# EAGLE design M8357pld (EAGLE 4.11)
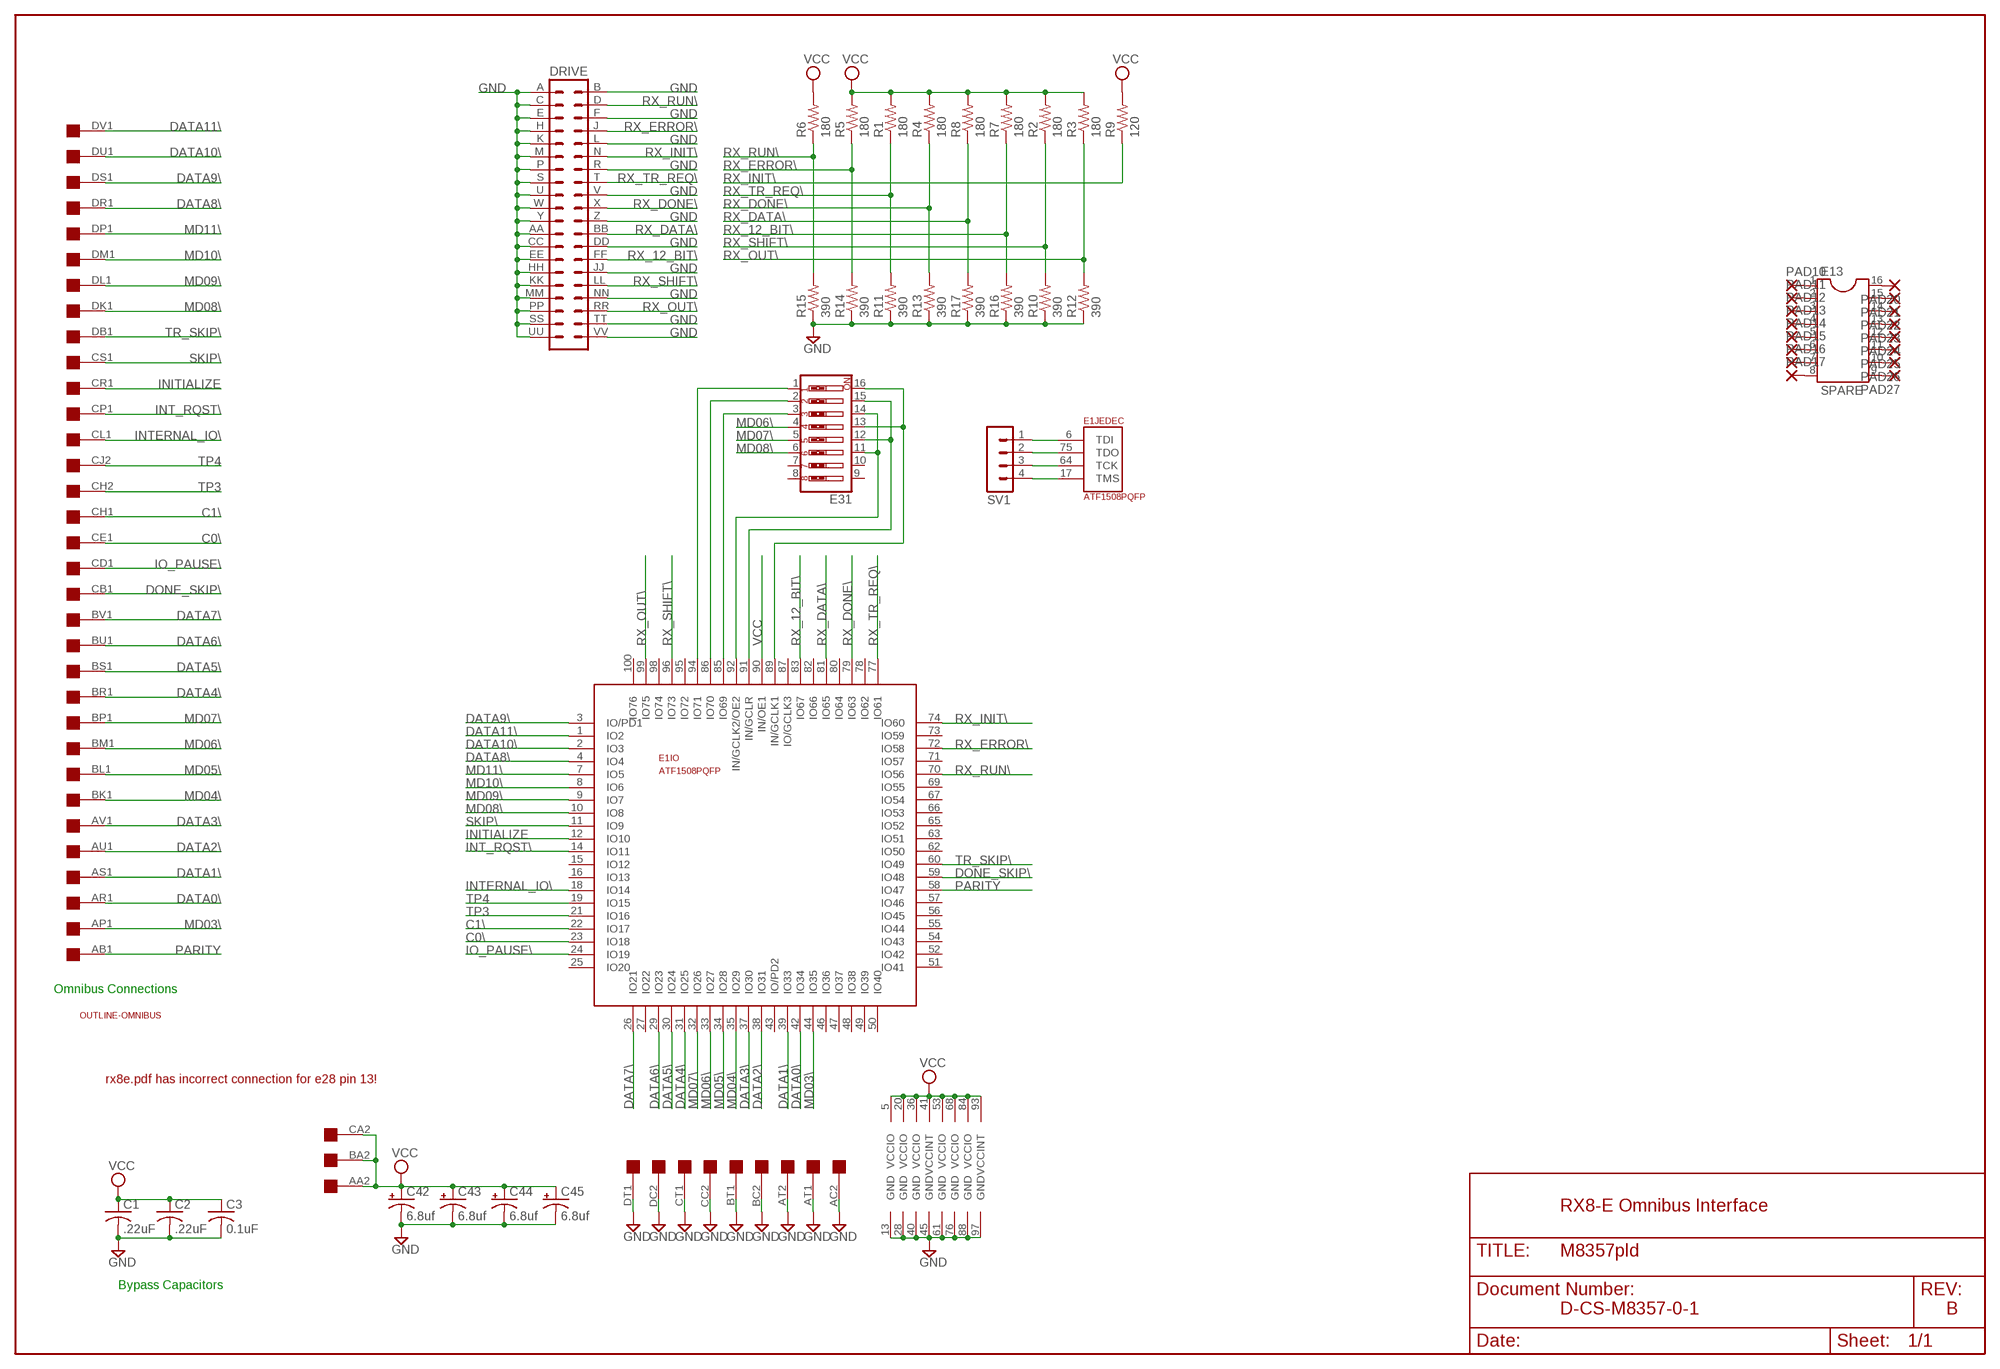
[diagram p0: schematic, sheet 1]

## Parts
C1  .22uF  C-US050-025X075  [C050-025X075]
C2  .22uF  C-US050-025X075  [C050-025X075]
C3  0.1uF  C-US050-025X075  [C050-025X075]
C42  6.8uf  CPOL-USE22-6AXIAL  [E22-6]
C43  6.8uf  CPOL-USE22-6AXIAL  [E22-6]
C44  6.8uf  CPOL-USE22-6AXIAL  [E22-6]
C45  6.8uf  CPOL-USE22-6AXIAL  [E22-6]
DRIVE  DEC40PINH  [DEC40PINH]
E1  ATF1508PQFP  [PQFP-100]
E13  SPARE  DIL16  [DIL16]
E31  SW_DIP-8  [EDG-08]
PAD10  1,6/0,8  [1,6/0,8]
PAD11  1,6/0,8  [1,6/0,8]
PAD12  1,6/0,8  [1,6/0,8]
PAD13  1,6/0,8  [1,6/0,8]
PAD14  1,6/0,8  [1,6/0,8]
PAD15  1,6/0,8  [1,6/0,8]
PAD16  1,6/0,8  [1,6/0,8]
PAD17  1,6/0,8  [1,6/0,8]
PAD20  1,6/0,8  [1,6/0,8]
PAD21  1,6/0,8  [1,6/0,8]
PAD22  1,6/0,8  [1,6/0,8]
PAD23  1,6/0,8  [1,6/0,8]
PAD24  1,6/0,8  [1,6/0,8]
PAD25  1,6/0,8  [1,6/0,8]
PAD26  1,6/0,8  [1,6/0,8]
PAD27  1,6/0,8  [1,6/0,8]
R1  180  R-US_0207/10  [0207/10]
R2  180  R-US_0207/10  [0207/10]
R3  180  R-US_0207/10  [0207/10]
R4  180  R-US_0207/10  [0207/10]
R5  180  R-US_0207/10  [0207/10]
R6  180  R-US_0207/10  [0207/10]
R7  180  R-US_0207/10  [0207/10]
R8  180  R-US_0207/10  [0207/10]
R9  120  R-US_0207/10  [0207/10]
R10  390  R-US_0207/10  [0207/10]
R11  390  R-US_0207/10  [0207/10]
R12  390  R-US_0207/10  [0207/10]
R13  390  R-US_0207/10  [0207/10]
R14  390  R-US_0207/10  [0207/10]
R15  390  R-US_0207/10  [0207/10]
R16  390  R-US_0207/10  [0207/10]
R17  390  R-US_0207/10  [0207/10]
SV1  MA04-1  [MA04-1]
U$2  QUAD  [EDGE-CON8]
U$5  OUTLINE-OMNIBUS  [OMNIBUS]

## Nets
C0\: E1.23(IO:IO18) U$2.CE1
C1\: E1.22(IO:IO17) U$2.CH1
DATA0\: E1.42(IO:IO34) U$2.AR1
DATA1\: E1.39(IO:IO33) U$2.AS1
DATA2\: E1.38(IO:IO31) U$2.AU1
DATA3\: E1.37(IO:IO30) U$2.AV1
DATA4\: E1.31(IO:IO25) U$2.BR1
DATA5\: E1.30(IO:IO24) U$2.BS1
DATA6\: E1.29(IO:IO23) U$2.BU1
DATA7\: E1.26(IO:IO21) U$2.BV1
DATA8\: E1.4(IO:IO4) U$2.DR1
DATA9\: E1.3(IO:IO/PD1) U$2.DS1
DATA10\: E1.2(IO:IO3) U$2.DU1
DATA11\: E1.1(IO:IO2) U$2.DV1
DONE_SKIP\: E1.59(IO:IO48) U$2.CB1
GND [supply]: C1.2 C2.2 C3.2 C42.- C43.- C44.- C45.- DRIVE.A DRIVE.AA DRIVE.B DRIVE.C DRIVE.CC DRIVE.DD DRIVE.E DRIVE.EE DRIVE.F DRIVE.H DRIVE.HH DRIVE.JJ DRIVE.K DRIVE.KK DRIVE.L DRIVE.M DRIVE.MM DRIVE.NN DRIVE.P DRIVE.PP DRIVE.R DRIVE.S DRIVE.SS DRIVE.TT DRIVE.U DRIVE.UU DRIVE.V DRIVE.VV DRIVE.W DRIVE.Y DRIVE.Z E1.13(GND) E1.28(GND) E1.40(GND) E1.45(GND) E1.61(GND) E1.76(GND) E1.88(GND) E1.97(GND) R10.1 R11.1 R12.1 R13.1 R14.1 R15.1 R16.1 R17.1 U$2.AC2 U$2.AT1 U$2.AT2 U$2.BC2 U$2.BT1 U$2.CC2 U$2.CT1 U$2.DC2 U$2.DT1
INITIALIZE: E1.12(IO:IO10) U$2.CR1
INT_RQST\: E1.14(IO:IO11) U$2.CP1
INTERNAL_IO\: E1.18(IO:IO14) U$2.CL1
IO_PAUSE\: E1.24(IO:IO19) U$2.CD1
MD03\: E1.44(IO:IO35) U$2.AP1
MD04\: E1.35(IO:IO29) U$2.BK1
MD05\: E1.34(IO:IO28) U$2.BL1
MD06\: E1.33(IO:IO27) E31.4 U$2.BM1
MD07\: E1.32(IO:IO26) E31.5 U$2.BP1
MD08\: E1.10(IO:IO8) E31.6 U$2.DK1
MD09\: E1.9(IO:IO7) U$2.DL1
MD10\: E1.8(IO:IO6) U$2.DM1
MD11\: E1.7(IO:IO5) U$2.DP1
N$1: E1.92(IO:IN/GCLK2/OE2) E31.11 E31.14
N$5: E1.91(IO:IN/GCLR) E31.12 E31.15
N$6: E1.89(IO:IN/GCLK1) E31.13 E31.16
N$7: E1.85(IO:IO69) E31.3
N$8: E1.86(IO:IO70) E31.2
N$9: E1.94(IO:IO71) E31.1
N$13: E13.1 PAD10.1(P)
N$14: E13.2 PAD11.1(P)
N$15: E13.3 PAD12.1(P)
N$16: E13.4 PAD13.1(P)
N$17: E13.5 PAD14.1(P)
N$18: E13.6 PAD15.1(P)
N$19: E13.7 PAD16.1(P)
N$20: E13.8 PAD17.1(P)
N$23: E13.16 PAD20.1(P)
N$24: E13.15 PAD21.1(P)
N$25: E13.14 PAD22.1(P)
N$26: E13.13 PAD23.1(P)
N$27: E13.12 PAD24.1(P)
N$28: E13.11 PAD25.1(P)
N$29: E13.10 PAD26.1(P)
N$30: E13.9 PAD27.1(P)
PARITY: E1.58(IO:IO47) U$2.AB1
RX_12_BIT\: DRIVE.FF E1.83(IO:IO67) R7.1 R16.2
RX_DATA\: DRIVE.BB E1.81(IO:IO65) R8.1 R17.2
RX_DONE\: DRIVE.X E1.79(IO:IO63) R4.1 R13.2
RX_ERROR\: DRIVE.J E1.72(IO:IO58) R5.1 R14.2
RX_INIT\: DRIVE.N E1.74(IO:IO60) R9.1
RX_OUT\: DRIVE.RR E1.99(IO:IO75) R3.1 R12.2
RX_RUN\: DRIVE.D E1.70(IO:IO56) R6.1 R15.2
RX_SHIFT\: DRIVE.LL E1.96(IO:IO73) R2.1 R10.2
RX_TR_REQ\: DRIVE.T E1.77(IO:IO61) R1.1 R11.2
SKIP\: E1.11(IO:IO9) U$2.CS1
TCK: E1.64(JEDEC:TCK) SV1.3
TDI: E1.6(JEDEC:TDI) SV1.1
TDO: E1.75(JEDEC:TDO) SV1.2
TMS: E1.17(JEDEC:TMS) SV1.4
TP3: E1.21(IO:IO16) U$2.CH2
TP4: E1.19(IO:IO15) U$2.CJ2
TR_SKIP\: E1.60(IO:IO49) U$2.DB1
VCC [supply]: C1.1 C2.1 C3.1 C42.+ C43.+ C44.+ C45.+ E1.5(VCCIO) E1.20(VCCIO) E1.36(VCCIO) E1.41(VCCINT) E1.53(VCCIO) E1.68(VCCIO) E1.84(VCCIO) E1.90(IO:IN/OE1) E1.93(VCCINT) R1.2 R2.2 R3.2 R4.2 R5.2 R6.2 R7.2 R8.2 R9.2 U$2.AA2 U$2.BA2 U$2.CA2
Unconnected: E1.15(IO:IO12) E1.16(IO:IO13) E1.25(IO:IO20) E1.27(IO:IO22) E1.43(IO:IO/PD2) E1.46(IO:IO36) E1.47(IO:IO37) E1.48(IO:IO38) E1.49(IO:IO39) E1.50(IO:IO40) E1.51(IO:IO41) E1.52(IO:IO42) E1.54(IO:IO43) E1.55(IO:IO44) E1.56(IO:IO45) E1.57(IO:IO46) E1.62(IO:IO50) E1.63(IO:IO51) E1.65(IO:IO52) E1.66(IO:IO53) E1.67(IO:IO54) E1.69(IO:IO55) E1.71(IO:IO57) E1.73(IO:IO59) E1.78(IO:IO62) E1.80(IO:IO64) E1.82(IO:IO66) E1.87(IO:IO/GCLK3) E1.95(IO:IO72) E1.98(IO:IO74) E1.100(IO:IO76) E31.7 E31.8 E31.9 E31.10 U$2.AA1 U$2.AB2 U$2.AC1 U$2.AD1 U$2.AD2 U$2.AE1 U$2.AE2 U$2.AF1 U$2.AF2 U$2.AH1 U$2.AH2 U$2.AJ1 U$2.AJ2 U$2.AK1 U$2.AK2 U$2.AL1 U$2.AL2 U$2.AM1 U$2.AM2 U$2.AN1 U$2.AN2 U$2.AP2 U$2.AR2 U$2.AS2 U$2.AU2 U$2.AV2 U$2.BA1 U$2.BB1 U$2.BB2 U$2.BC1 U$2.BD1 U$2.BD2 U$2.BE1 U$2.BE2 U$2.BF1 U$2.BF2 U$2.BH1 U$2.BH2 U$2.BJ1 U$2.BJ2 U$2.BK2 U$2.BL2 U$2.BM2 U$2.BN1 U$2.BN2 U$2.BP2 U$2.BR2 U$2.BS2 U$2.BT2 U$2.BU2 U$2.BV2 U$2.CA1 U$2.CB2 U$2.CC1 U$2.CD2 U$2.CE2 U$2.CF1 U$2.CF2 U$2.CJ1 U$2.CK1 U$2.CK2 U$2.CL2 U$2.CM1 U$2.CM2 U$2.CN1 U$2.CN2 U$2.CP2 U$2.CR2 U$2.CS2 U$2.CT2 U$2.CU1 U$2.CU2 U$2.CV1 U$2.CV2 U$2.DA1 U$2.DA2 U$2.DB2 U$2.DC1 U$2.DD1 U$2.DD2 U$2.DE1 U$2.DE2 U$2.DF1 U$2.DF2 U$2.DH1 U$2.DH2 U$2.DJ1 U$2.DJ2 U$2.DK2 U$2.DL2 U$2.DM2 U$2.DN1 U$2.DN2 U$2.DP2 U$2.DR2 U$2.DS2 U$2.DT2 U$2.DU2 U$2.DV2

## Notes on the sheet
- Omnibus Connections
- rx8e.pdf has incorrect connection for e28 pin 13!
- RX8-E Omnibus Interface
- Bypass Capacitors
- D-CS-M8357-0-1 | B

## Library data of the parts
C1-C3 = rcl:C-US: CAPACITOR, American symbol
C42-C45 = rcl:CPOL-US: POLARIZED CAPACITOR, American symbol
DRIVE = dec-con:DEC40PIN: PIN HEADER
E1 = atmel-cpld:ATF1508: ATD1508 CPLD
E13 = ic-package:DIL16: Dual In Line
E31 = special:SW_DIP-8: DIP SWITCH
PAD10-PAD17 PAD20-PAD27 = wirepad:1,6/0,8: THROUGH-HOLE PAD
R1-R17 = rcl:R-US_: RESISTOR, American symbol
SV1 = con-lstb:MA04-1: PIN HEADER
U$2 = dec-con:QUAD: Quad-Height DEC board
U$5 = dec-con:OUTLINE-*: Board outlines for DEC boards.

## Board
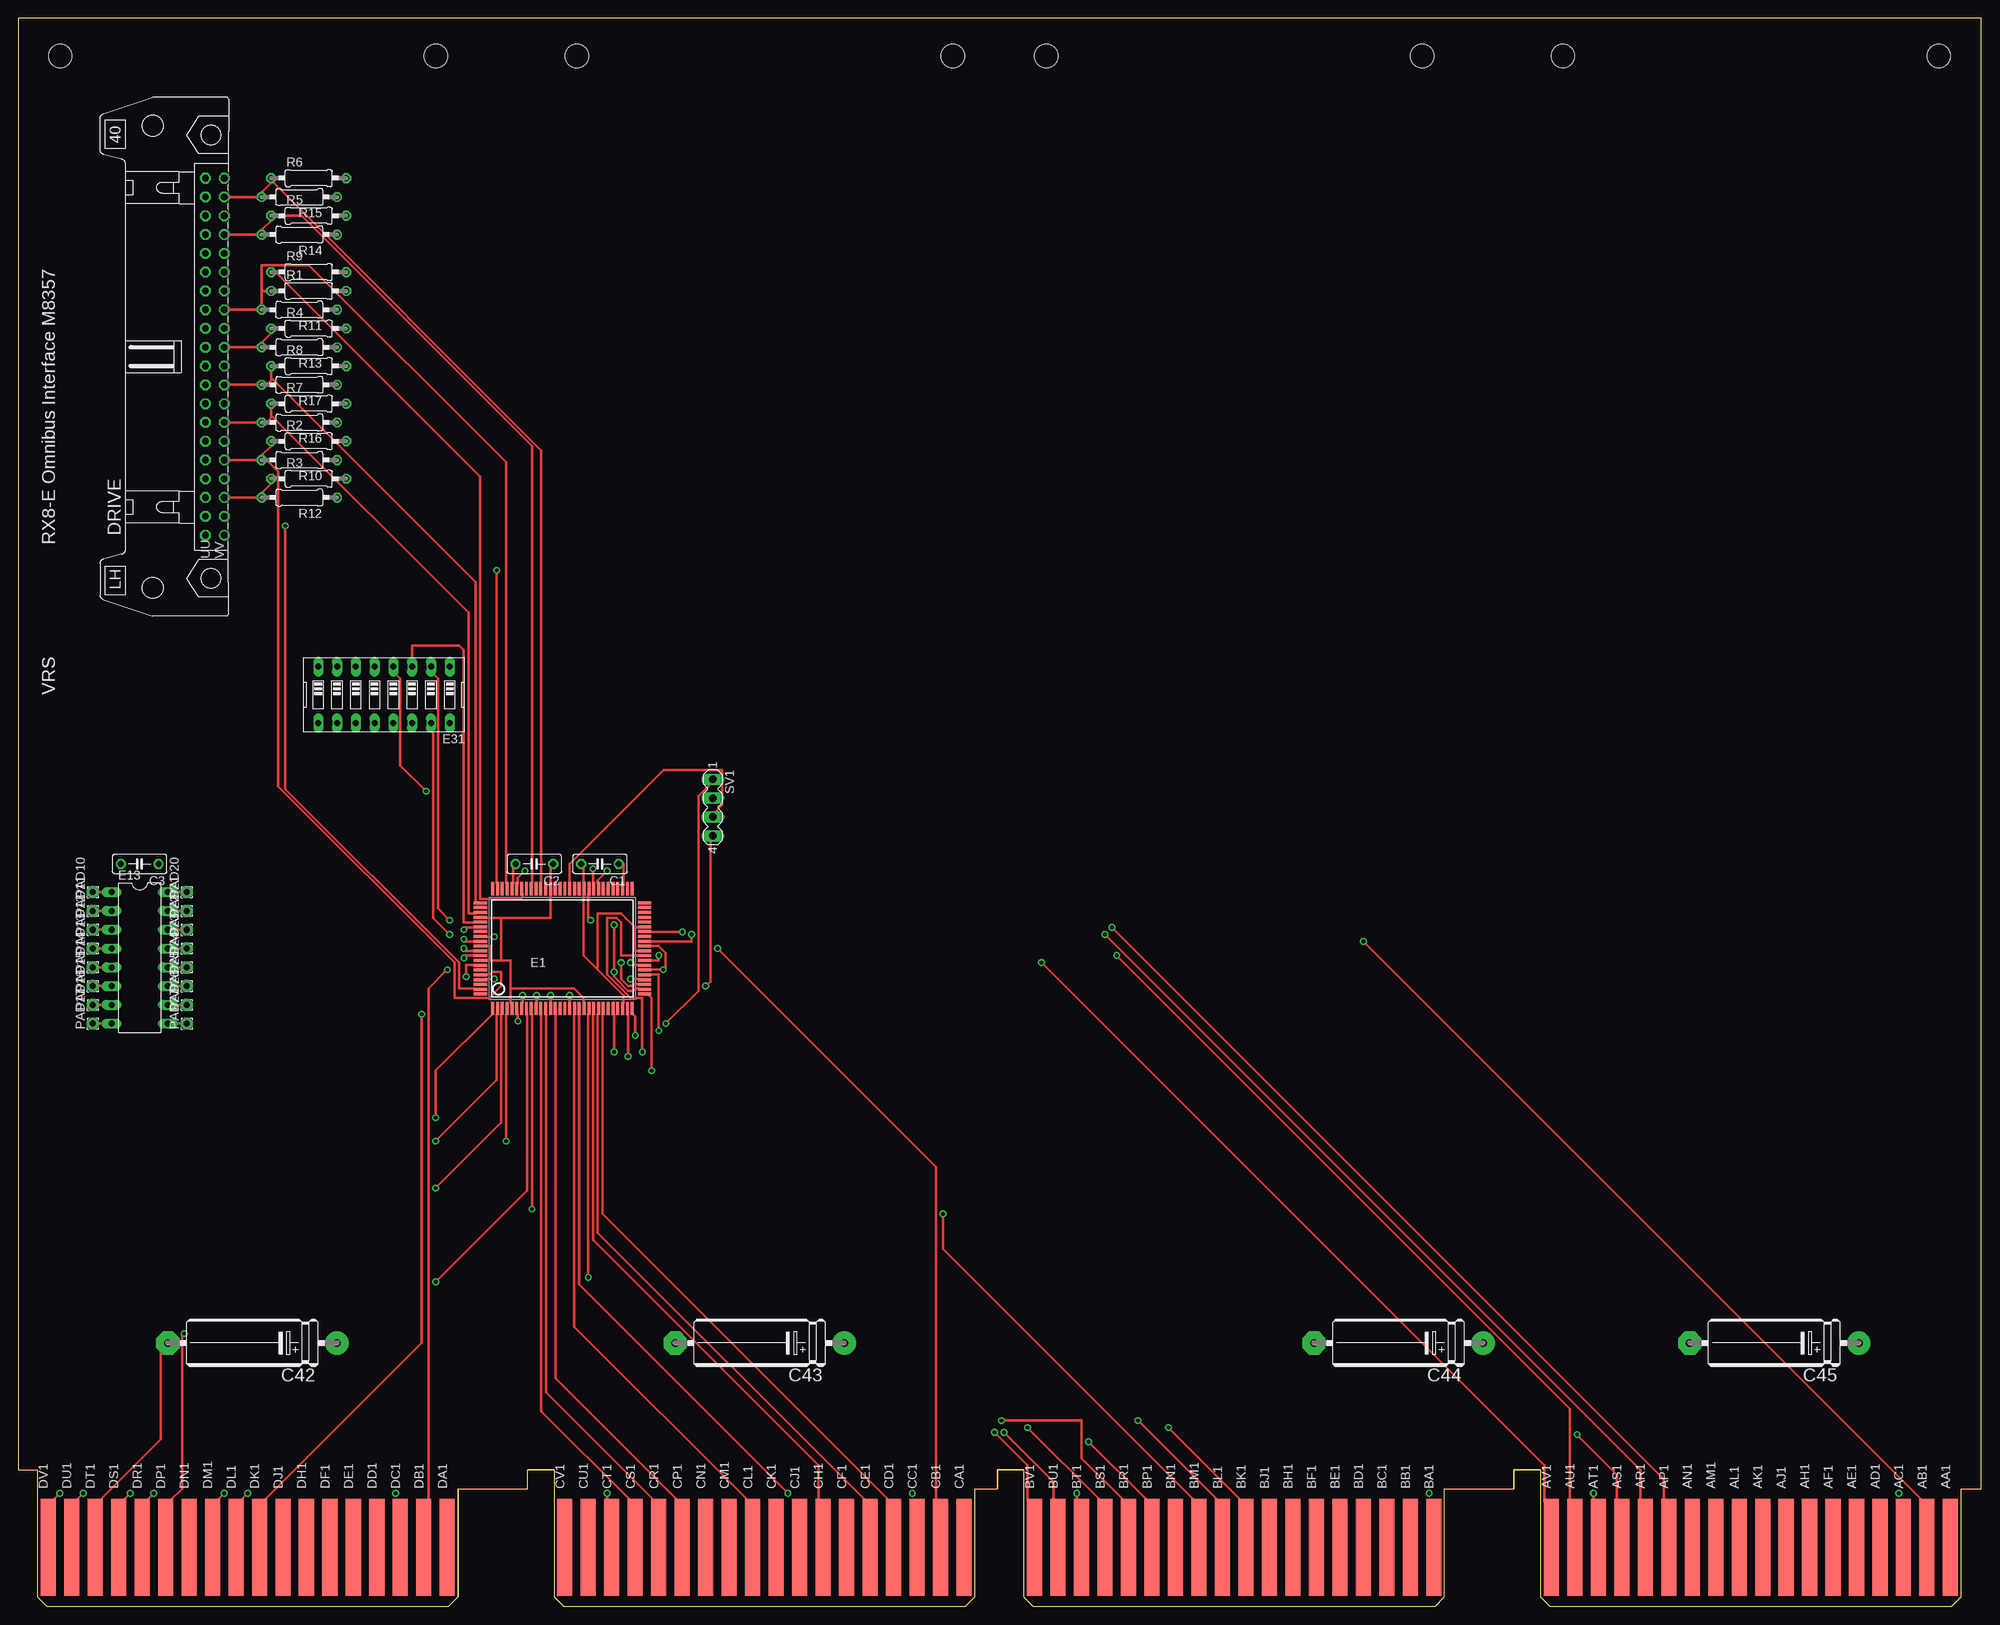
[diagram p1: board, top side]
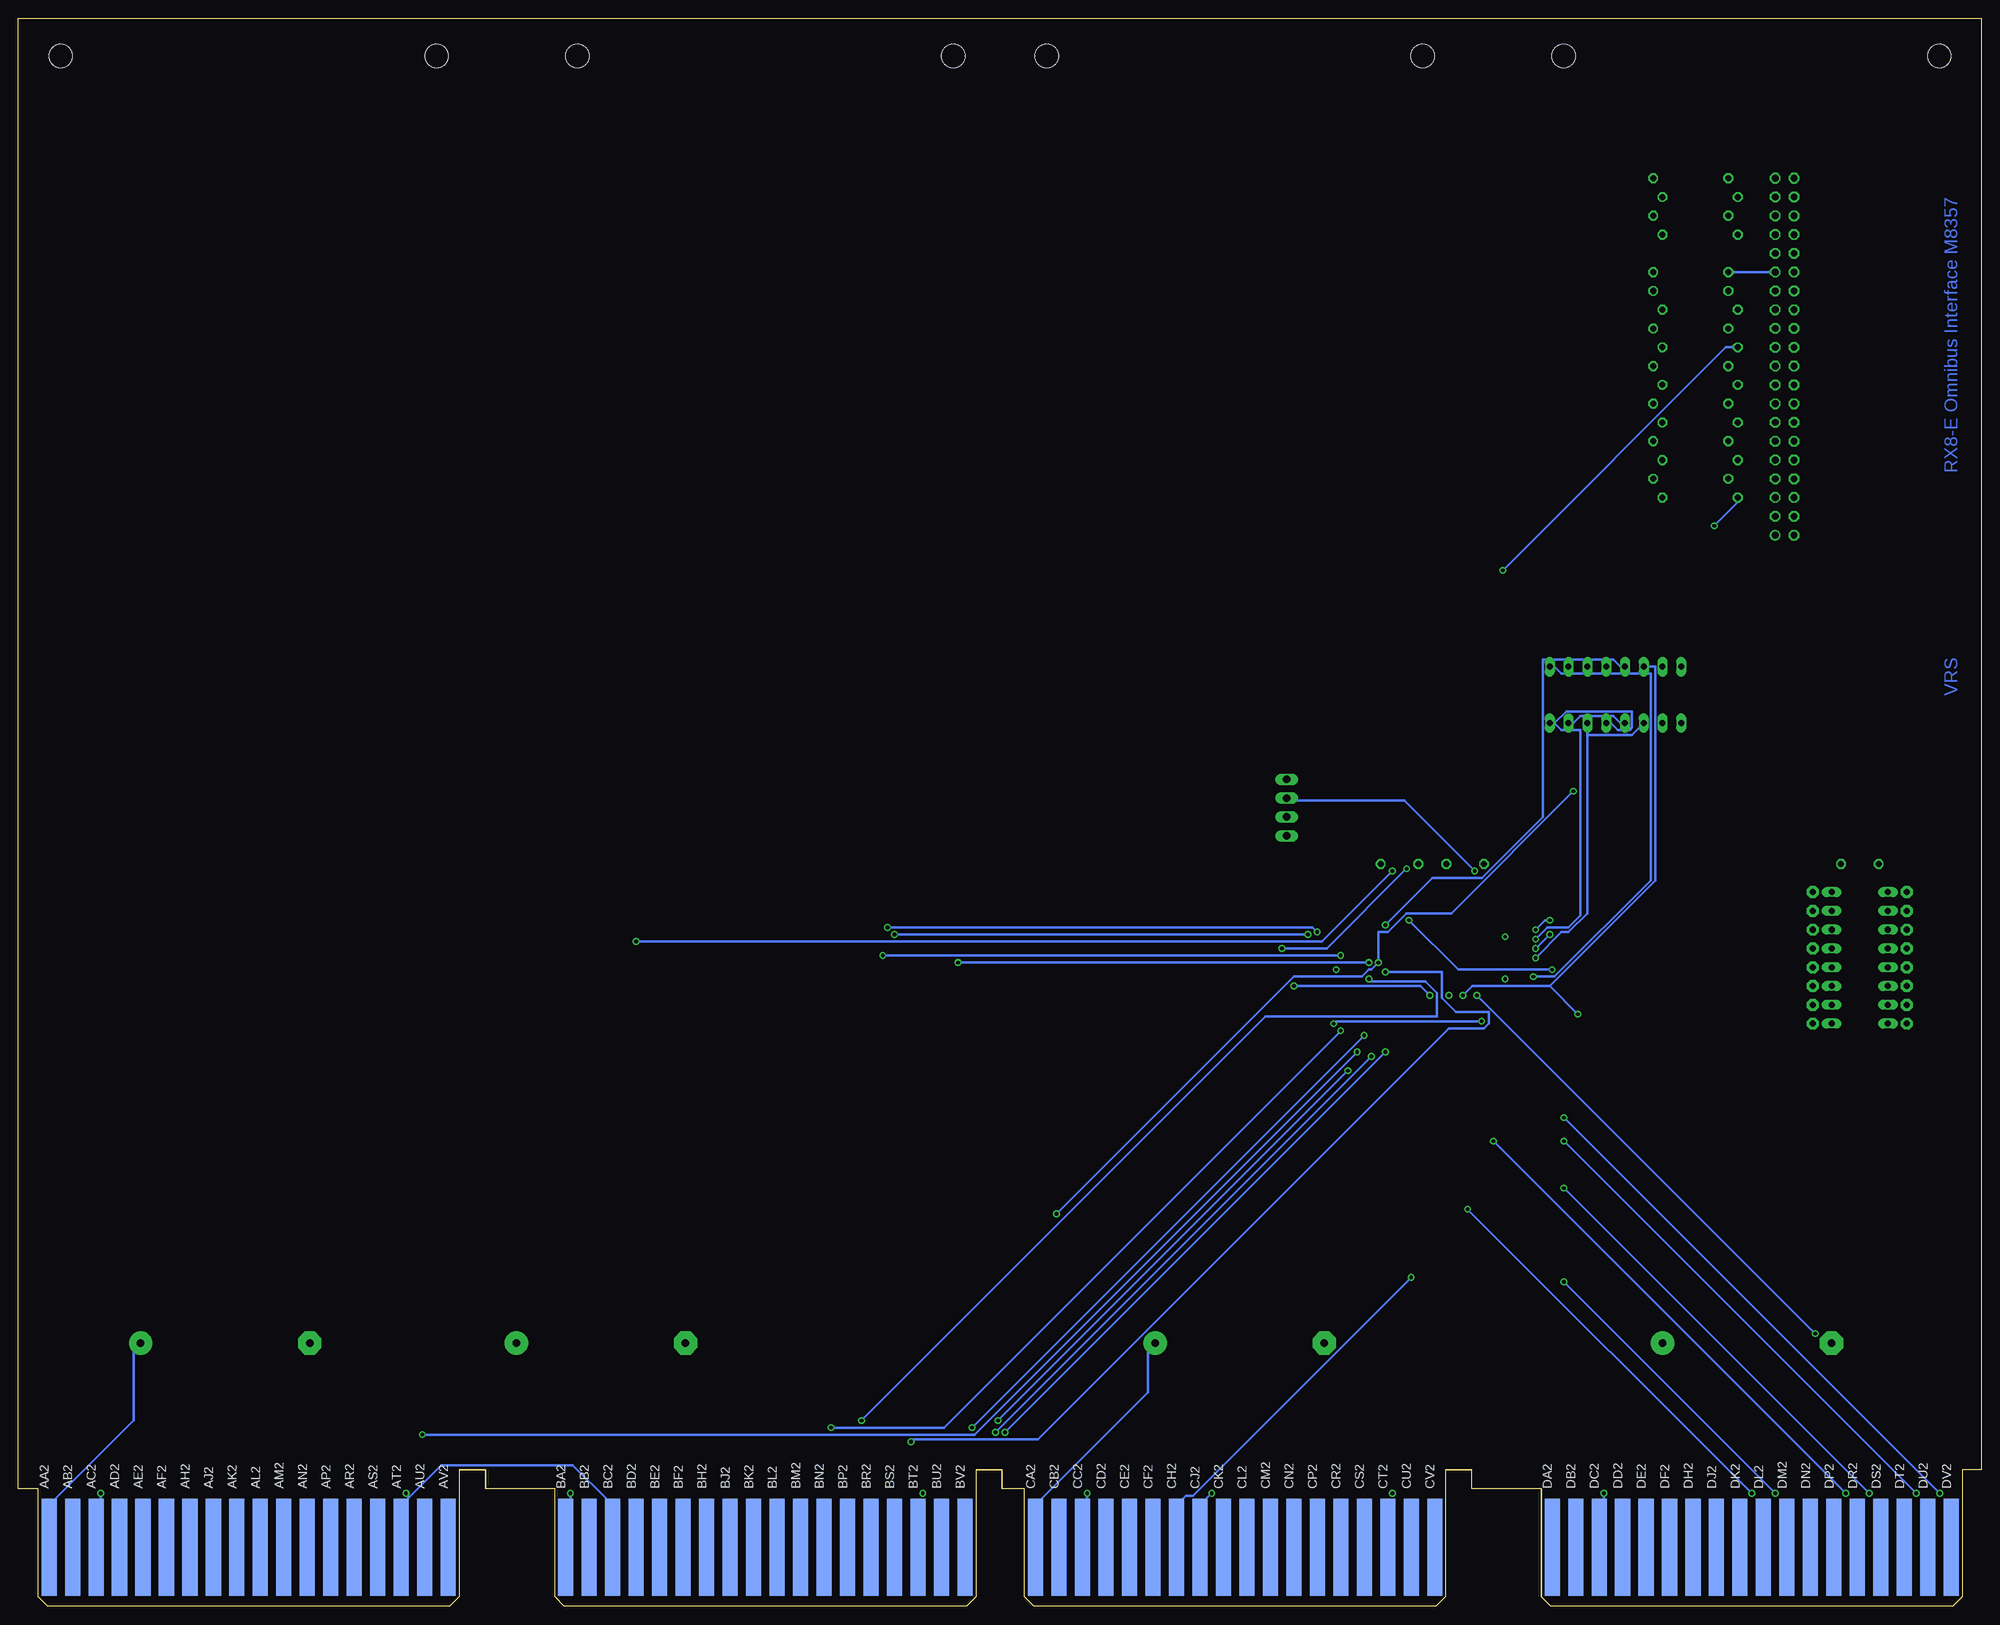
[diagram p2: board, bottom side, seen from below]

Size 265.3 x 214.63 mm. Coordinates in mm from the lower left corner, seen from the top.
Copper layers (1+2+3+16): Top 0.035mm / dielectric 1.5mm / $VCC 0.035mm / dielectric 0.15mm / $GND 0.035mm / dielectric 0.2mm / Bottom 0.035mm
Design rules "pld": minimum track width 12mil, minimum drill 20mil, track to track 5mil, track to pad 5mil, pad to pad 5mil, via to via 10mil, smd to smd 10mil, copper to edge 13mil, drill to drill 10mil, minimum pad ring 10mil, minimum via ring 8mil, stop-mask expansion 0mil, vias tented up to drill 0mil, thermal gap 10mil

### Footprints (pad centres in the part's own frame; a part is rotated, then mirrored left to right if it is on the bottom)
C050-025X075 = drill 0.813 octagon: 1 -2.54,0; 2 2.54,0
E22-6 = drill 1.016 pad 3.15 round: + -11.43,0 | drill 1.016 pad 3.15 octagon: - 11.43,0
DEC40PINH = drill 0.914 octagon: A 24.13,1.27; AA -3.81,1.27; B 24.13,-1.27; BB -3.81,-1.27; C 21.59,1.27; CC -6.35,1.27; D 21.59,-1.27; DD -6.35,-1.27; E 19.05,1.27; EE -8.89,1.27; F 19.05,-1.27; FF -8.89,-1.27; H 16.51,1.27; HH -11.43,1.27; J 16.51,-1.27; JJ -11.43,-1.27; K 13.97,1.27; KK -13.97,1.27; L 13.97,-1.27; LL -13.97,-1.27; M 11.43,1.27; MM -16.51,1.27; N 11.43,-1.27; NN -16.51,-1.27; P 8.89,1.27; PP -19.05,1.27; R 8.89,-1.27; RR -19.05,-1.27; S 6.35,1.27; SS -21.59,1.27; T 6.35,-1.27; TT -21.59,-1.27; U 3.81,1.27; UU -24.13,1.27; V 3.81,-1.27; W 1.27,1.27; X 1.27,-1.27; Y -1.27,1.27; Z -1.27,-1.27 | drill 0.914 round: VV -24.13,-1.27
PQFP-100 = smd 0.4 x 1.8: 1 -9.425,-8.1; 2 -8.775,-8.1; 3 -8.125,-8.1; 4 -7.475,-8.1; 5 -6.825,-8.1; 6 -6.175,-8.1; 7 -5.525,-8.1; 8 -4.875,-8.1; 9 -4.225,-8.1; 10 -3.575,-8.1; 11 -2.925,-8.1; 12 -2.275,-8.1; 13 -1.625,-8.1; 14 -0.975,-8.1; 15 -0.325,-8.1; 16 0.325,-8.1; 17 0.975,-8.1; 18 1.625,-8.1; 19 2.275,-8.1; 20 2.925,-8.1; 21 3.575,-8.1; 22 4.225,-8.1; 23 4.875,-8.1; 24 5.525,-8.1; 25 6.175,-8.1; 26 6.825,-8.1; 27 7.475,-8.1; 28 8.125,-8.1; 29 8.775,-8.1; 30 9.425,-8.1; 51 9.425,8.1; 52 8.775,8.1; 53 8.125,8.1; 54 7.475,8.1; 55 6.825,8.1; 56 6.175,8.1; 57 5.525,8.1; 58 4.875,8.1; 59 4.225,8.1; 60 3.575,8.1; 61 2.925,8.1; 62 2.275,8.1; 63 1.625,8.1; 64 0.975,8.1; 65 0.325,8.1; 66 -0.325,8.1; 67 -0.975,8.1; 68 -1.625,8.1; 69 -2.275,8.1; 70 -2.925,8.1; 71 -3.575,8.1; 72 -4.225,8.1; 73 -4.875,8.1; 74 -5.525,8.1; 75 -6.175,8.1; 76 -6.825,8.1; 77 -7.475,8.1; 78 -8.125,8.1; 79 -8.775,8.1; 80 -9.425,8.1 | smd 1.8 x 0.4: 31 11.1,-6.175; 32 11.1,-5.525; 33 11.1,-4.875; 34 11.1,-4.225; 35 11.1,-3.575; 36 11.1,-2.925; 37 11.1,-2.275; 38 11.1,-1.625; 39 11.1,-0.975; 40 11.1,-0.325; 41 11.1,0.325; 42 11.1,0.975; 43 11.1,1.625; 44 11.1,2.275; 45 11.1,2.925; 46 11.1,3.575; 47 11.1,4.225; 48 11.1,4.875; 49 11.1,5.525; 50 11.1,6.175; 81 -11.1,6.175; 82 -11.1,5.525; 83 -11.1,4.875; 84 -11.1,4.225; 85 -11.1,3.575; 86 -11.1,2.925; 87 -11.1,2.275; 88 -11.1,1.625; 89 -11.1,0.975; 90 -11.1,0.325; 91 -11.1,-0.325; 92 -11.1,-0.975; 93 -11.1,-1.625; 94 -11.1,-2.275; 95 -11.1,-2.925; 96 -11.1,-3.575; 97 -11.1,-4.225; 98 -11.1,-4.875; 99 -11.1,-5.525; 100 -11.1,-6.175
DIL16 = drill 0.813 long: 1 -8.89,-3.81; 2 -6.35,-3.81; 3 -3.81,-3.81; 4 -1.27,-3.81; 5 1.27,-3.81; 6 3.81,-3.81; 7 6.35,-3.81; 8 8.89,-3.81; 9 8.89,3.81; 10 6.35,3.81; 11 3.81,3.81; 12 1.27,3.81; 13 -1.27,3.81; 14 -3.81,3.81; 15 -6.35,3.81; 16 -8.89,3.81
EDG-08 = drill 0.813 long: 1 -8.89,-3.81; 2 -6.35,-3.81; 3 -3.81,-3.81; 4 -1.27,-3.81; 5 1.27,-3.81; 6 3.81,-3.81; 7 6.35,-3.81; 8 8.89,-3.81; 9 8.89,3.81; 10 6.35,3.81; 11 3.81,3.81; 12 1.27,3.81; 13 -1.27,3.81; 14 -3.81,3.81; 15 -6.35,3.81; 16 -8.89,3.81
1,6/0,8 = drill 0.813 pad 1.6 octagon: 1 0,0
0207/10 = drill 0.813 octagon: 1 -5.08,0; 2 5.08,0
MA04-1 = drill 1.016 long: 1 -3.81,0; 2 -1.27,0; 3 1.27,0; 4 3.81,0
EDGE-CON8 = smd 2.032 x 13.106: AA1 261.303,7.938; AB1 258.127,7.938; AC1 254.952,7.938; AD1 251.778,7.938; AE1 248.602,7.938; AF1 245.428,7.938; AH1 242.252,7.938; AJ1 239.077,7.938; AK1 235.903,7.938; AL1 232.727,7.938; AM1 229.553,7.938; AN1 226.377,7.938; AP1 223.202,7.938; AR1 220.028,7.938; AS1 216.852,7.938; AT1 213.678,7.938; AU1 210.502,7.938; AV1 207.327,7.938; BA1 191.452,7.938; BB1 188.278,7.938; BC1 185.102,7.938; BD1 181.928,7.938; BE1 178.752,7.938; BF1 175.577,7.938; BH1 172.403,7.938; BJ1 169.227,7.938; BK1 166.053,7.938; BL1 162.877,7.938; BM1 159.702,7.938; BN1 156.528,7.938; BP1 153.352,7.938; BR1 150.178,7.938; BS1 147.002,7.938; BT1 143.827,7.938; BU1 140.653,7.938; BV1 137.477,7.938; CA1 127.953,7.938; CB1 124.778,7.938; CC1 121.603,7.938; CD1 118.427,7.938; CE1 115.252,7.938; CF1 112.078,7.938; CH1 108.903,7.938; CJ1 105.728,7.938; CK1 102.552,7.938; CL1 99.377,7.938; CM1 96.203,7.938; CN1 93.028,7.938; CP1 89.853,7.938; CR1 86.677,7.938; CS1 83.502,7.938; CT1 80.328,7.938; CU1 77.153,7.938; CV1 73.978,7.938; DA1 58.102,7.938; DB1 54.928,7.938; DC1 51.752,7.938; DD1 48.578,7.938; DE1 45.403,7.938; DF1 42.227,7.938; DH1 39.053,7.938; DJ1 35.877,7.938; DK1 32.703,7.938; DL1 29.527,7.938; DM1 26.352,7.938; DN1 23.177,7.938; DP1 20.003,7.938; DR1 16.828,7.938; DS1 13.652,7.938; DT1 10.477,7.938; DU1 7.303,7.938; DV1 4.128,7.938 | smd 2.032 x 13.106 bottom: AA2 261.303,7.938; AB2 258.127,7.938; AC2 254.952,7.938; AD2 251.778,7.938; AE2 248.602,7.938; AF2 245.428,7.938; AH2 242.252,7.938; AJ2 239.077,7.938; AK2 235.903,7.938; AL2 232.727,7.938; AM2 229.553,7.938; AN2 226.377,7.938; AP2 223.202,7.938; AR2 220.028,7.938; AS2 216.852,7.938; AT2 213.678,7.938; AU2 210.502,7.938; AV2 207.327,7.938; BA2 191.452,7.938; BB2 188.278,7.938; BC2 185.102,7.938; BD2 181.928,7.938; BE2 178.752,7.938; BF2 175.577,7.938; BH2 172.403,7.938; BJ2 169.227,7.938; BK2 166.053,7.938; BL2 162.877,7.938; BM2 159.702,7.938; BN2 156.528,7.938; BP2 153.352,7.938; BR2 150.178,7.938; BS2 147.002,7.938; BT2 143.827,7.938; BU2 140.653,7.938; BV2 137.477,7.938; CA2 127.953,7.938; CB2 124.778,7.938; CC2 121.603,7.938; CD2 118.427,7.938; CE2 115.252,7.938; CF2 112.078,7.938; CH2 108.903,7.938; CJ2 105.728,7.938; CK2 102.552,7.938; CL2 99.377,7.938; CM2 96.203,7.938; CN2 93.028,7.938; CP2 89.853,7.938; CR2 86.677,7.938; CS2 83.502,7.938; CT2 80.328,7.938; CU2 77.153,7.938; CV2 73.978,7.938; DA2 58.102,7.938; DB2 54.928,7.938; DC2 51.752,7.938; DD2 48.578,7.938; DE2 45.403,7.938; DF2 42.227,7.938; DH2 39.053,7.938; DJ2 35.877,7.938; DK2 32.703,7.938; DL2 29.527,7.938; DM2 26.352,7.938; DN2 23.177,7.938; DP2 20.003,7.938; DR2 16.828,7.938; DS2 13.652,7.938; DT2 10.477,7.938; DU2 7.303,7.938; DV2 4.128,7.938
OMNIBUS = hole 3.175: 208.915,209.55; 259.715,209.55; 189.865,209.55; 139.065,209.55; 75.616,209.55; 126.416,209.55; 56.566,209.55; 5.766,209.55

### Placement (x,y rotation side)
C1  78.61,100.33 180 top
C2  69.72,100.33 180 top
C3  16.38,100.33 180 top
C42  31.62,35.56 180 top
C43  100.2,35.56 180 top
C44  186.56,35.56 180 top
C45  237.36,35.56 180 top
DRIVE  26.54,168.91 90 top
E1  73.53,88.9 0 top
E13  16.38,87.63 270 top
E31  49.4,123.19 180 top
PAD10  10.03,96.52 90 top
PAD11  10.03,93.98 90 top
PAD12  10.03,91.44 90 top
PAD13  10.03,88.9 90 top
PAD14  10.03,86.36 90 top
PAD15  10.03,83.82 90 top
PAD16  10.03,81.28 90 top
PAD17  10.03,78.74 90 top
PAD20  22.73,96.52 90 top
PAD21  22.73,93.98 90 top
PAD22  22.73,91.44 90 top
PAD23  22.73,88.9 90 top
PAD24  22.73,86.36 90 top
PAD25  22.73,83.82 90 top
PAD26  22.73,81.28 90 top
PAD27  22.73,78.74 90 top
R1  39.24,177.8 0 top
R2  39.24,157.48 0 top
R3  39.24,152.4 0 top
R4  39.24,172.72 0 top
R5  39.24,187.96 0 top
R6  39.24,193.04 0 top
R7  39.24,162.56 0 top
R8  39.24,167.64 0 top
R9  39.24,180.34 0 top
R10  37.97,154.94 180 top
R11  37.97,175.26 180 top
R12  37.97,149.86 180 top
R13  37.97,170.18 180 top
R14  37.97,185.42 180 top
R15  37.97,190.5 180 top
R16  37.97,160.02 180 top
R17  37.97,165.1 180 top
SV1  93.85,107.95 270 top
U$2  -0.13,0 0 top
U$5  -0.13,0 0 top

### Tracks (layer width: path | path; a pad name or v marks a point on that pad's centre or on a via)
C0\
  Top 0.305: E1.23 78.3,80.01 78.3,50.48 114.49,14.29 U$2.CE1
C1\
  Top 0.305: E1.22 77.66,80.01 77.66,49.53 108.14,19.05 108.14,14.29 U$2.CH1
DATA0\  (via drill 0.51)
  Top 0.305: v91,90.81 91,89.85 85.28,89.85 E1.42 | v146.88,90.81 219.27,18.41 219.27,14.29 U$2.AR1
  Bottom 0.305: v91,90.81 v146.88,90.81
DATA1\  (via drill 0.51)
  Top 0.305: v84.33,74.93 84.33,82.23 82.74,82.23 79.56,85.41 79.56,93.03 80.84,93.03 81.47,92.39 81.47,87.95 84.01,87.95 E1.39 | v210.69,23.18 216.09,17.78 216.09,14.29 U$2.AS1
  Bottom 0.305: v84.33,74.93 136.08,23.18 v210.69,23.18
DATA2\  (via drill 0.51)
  Top 0.305: v86.55,87.95 86.55,87.31 85.28,87.31 E1.38 | v148.46,87.95 209.74,26.67 209.74,14.29 U$2.AU1
  Bottom 0.305: v86.55,87.95 v148.46,87.95
DATA3\  (via drill 0.51)
  Top 0.305: v82.74,87 82.74,86.68 84.01,86.68 E1.37 | v138.3,87 206.25,19.05 206.25,14.29 U$2.AV1
  Bottom 0.305: v82.74,87 v138.3,87
DATA4\  (via drill 0.51)
  Top 0.305: v85.6,72.39 85.6,82.23 85.28,82.55 E1.31 | v132.91,25.08 143.7,25.08 143.7,20 149.41,14.29 U$2.BR1
  Bottom 0.305: v132.91,25.08 v85.6,72.39
DATA5\  (via drill 0.51)
  Top 0.305: v83.38,77.15 83.38,79.69 83.06,80.01 E1.30 | v136.4,24.13 146.24,14.29 U$2.BS1
  Bottom 0.305: v136.4,24.13 v83.38,77.15
DATA6\  (via drill 0.51)
  Top 0.305: v82.42,74.3 82.42,80.01 E1.29 | v133.22,23.5 139.89,16.83 139.89,14.29 U$2.BU1
  Bottom 0.305: v133.22,23.5 v82.42,74.3
DATA7\  (via drill 0.51)
  Top 0.305: v80.52,74.93 80.52,80.01 E1.26 | v131.95,23.5 136.4,19.05 136.4,14.29 U$2.BV1
  Bottom 0.305: v131.95,23.5 v80.52,74.93
DATA8\  (via drill 0.51)
  Top 0.305: v65.91,62.87 65.91,80.01 E1.4 | v18.29,15.24 17.34,14.29 U$2.DR1
  Bottom 0.305: v18.29,15.24 v65.91,62.87
DATA9\  (via drill 0.51)
  Top 0.305: v56.39,56.52 65.28,65.41 65.28,80.01 E1.3 | v15.11,15.24 14.16,14.29 U$2.DS1
  Bottom 0.305: v15.11,15.24 v56.39,56.52
DATA10\  (via drill 0.51)
  Top 0.305: v56.39,62.87 64.64,71.12 64.64,80.01 E1.2 | v8.76,15.24 7.81,14.29 U$2.DU1
  Bottom 0.305: v8.76,15.24 v56.39,62.87
DATA11\  (via drill 0.51)
  Top 0.305: v56.39,66.04 56.39,72.39 64.01,80.01 E1.1 | v5.59,15.24 4.64,14.29 U$2.DV1
  Bottom 0.305: v5.59,15.24 v56.39,66.04
DONE_SKIP\  (via drill 0.51)
  Top 0.305: v77.66,99.69 77.66,97.79 E1.59 | v94.49,88.9 124.02,59.37 124.02,14.29 U$2.CB1
  Bottom 0.305: v77.66,99.69 88.45,88.9 v94.49,88.9
GND  (via drill 0.51)
  Top 0.305: 83.38,91.76 83.38,88.58 84.01,88.58 E1.40 | 83.38,91.76 84.01,91.76 E1.45 | v64.33,84.77 63.05,84.77 E1.97 | v64.33,90.49 63.05,90.49 E1.88 | v71.95,82.55 71.95,81.6 E1.13 | E1.76 66.87,97.79 66.87,100.01 C2.2 | C1.2 76.39,100.01 76.39,97.79 E1.61 76.39,96.2 76.39,87.95 78.3,86.04 | 78.3,86.04 81.79,82.55 81.79,81.6 E1.28 | 83.38,91.76 81.47,93.66 78.3,93.66 78.3,86.04 | U$2.DT1 10.99,14.29 19.24,22.54 19.24,34.29 C42.- | v79.56,15.24 79.56,14.29 U$2.CT1 | v143.06,15.24 143.06,14.29 U$2.BT1 | v212.91,15.24 212.91,14.29 U$2.AT2
  Bottom 0.305: 212.6,14.61 212.91,14.29 U$2.AT2 | 212.6,14.61 208.15,19.05 190.37,19.05 185.61,14.29 U$2.BC2 | v50.99,15.24 50.99,14.29 U$2.DC2 | v120.84,15.24 120.84,14.29 U$2.CC2 | v254.19,15.24 254.19,14.29 U$2.AC2 | 212.6,14.61 212.6,14.92 v212.91,15.24
INITIALIZE
  Top 0.305: E1.12 71.31,80.01 71.31,28.89 85.92,14.29 U$2.CR1
INT_RQST\
  Top 0.305: E1.14 72.58,80.01 72.58,30.8 89.09,14.29 U$2.CP1
INTERNAL_IO\
  Top 0.305: E1.18 75.12,80.01 75.12,37.78 98.62,14.29 U$2.CL1
IO_PAUSE\
  Top 0.305: E1.24 78.93,80.01 78.93,53.02 117.67,14.29 U$2.CD1
MD03\  (via drill 0.51)
  Top 0.305: v89.73,91.12 85.28,91.12 E1.44 | v147.83,91.76 222.44,17.14 222.44,14.29 U$2.AP1
  Bottom 0.305: v89.73,91.12 90.36,91.76 v147.83,91.76
MD04\  (via drill 0.51)
  Top 0.305: v86.55,77.79 86.55,85.41 85.28,85.41 E1.35 | v155.45,24.13 165.29,14.29 U$2.BK1
  Bottom 0.305: v86.55,77.79 140.21,24.13 v155.45,24.13
MD05\  (via drill 0.51)
  Top 0.305: v82.74,84.77 84.01,84.77 E1.34 | v151.32,25.08 162.12,14.29 U$2.BL1
  Bottom 0.305: v82.74,84.77 82.42,84.45 75.12,84.45 73.53,82.87 73.53,79.69 96.71,79.69 v151.32,25.08
MD06\  (via drill 0.51)
  Top 0.305: v81.47,87 81.47,84.77 82.42,83.82 83.06,83.82 83.38,84.14 84.01,84.14 E1.33 | v55.12,110.17 51.62,113.67 51.62,125.41 50.67,126.36 E31.4 | v124.97,53.02 124.97,48.26 158.94,14.29 U$2.BM1
  Bottom 0.305: v55.12,110.17 71.63,93.66 77.66,93.66 80.2,91.12 81.47,91.12 v81.47,87 82.42,86.04 82.74,86.04 83.69,85.09 92.9,85.09 v124.97,53.02
MD07\  (via drill 0.51)
  Top 0.305: v80.52,92.08 v80.52,85.72 80.52,85.09 82.42,83.19 83.06,83.19 83.38,83.5 84.01,83.5 E1.32 | v144.65,22.23 152.59,14.29 U$2.BP1
  Bottom 0.305: v80.52,92.08 74.17,98.42 67.5,98.42 59.25,106.68 59.25,127.95 49.72,127.95 48.77,127 E31.5 | v144.65,22.23 144.34,22.54 127.51,22.54 71.95,78.11 67.18,78.11 66.55,78.74 66.55,80.33 70.99,80.33 72.9,82.23 72.9,85.72 v80.52,85.72
MD08\  (via drill 0.51)
  Top 0.305: v70.04,82.55 70.04,81.6 E1.10 | v54.48,80.01 54.48,35.56 33.21,14.29 U$2.DK1
  Bottom 0.305: v70.04,82.55 68.77,83.82 58.29,83.82 | 58.29,83.82 44.01,98.11 44.01,127 E31.6 | v54.48,80.01 58.29,83.82
MD09\  (via drill 0.51)
  Top 0.305: v69.41,53.66 69.41,80.01 E1.9 | v30.99,15.24 30.04,14.29 U$2.DL1
  Bottom 0.305: v30.99,15.24 v69.41,53.66
MD10\  (via drill 0.51)
  Top 0.305: v56.39,43.81 68.77,56.2 68.77,80.01 E1.8 | v27.81,15.24 26.86,14.29 U$2.DM1
  Bottom 0.305: v27.81,15.24 v56.39,43.81
MD11\  (via drill 0.51)
  Top 0.305: v68.14,82.55 68.14,81.6 E1.7 | v22.42,36.83 22.1,36.51 22.1,15.88 20.51,14.29 U$2.DP1
  Bottom 0.305: v22.42,36.83 v68.14,82.55
N$1  (via drill 0.51)
  Top 0.305: v60.2,87.63 60.2,87.95 61.79,87.95 E1.92
  Bottom 0.305: v60.2,87.63 56.71,91.12 55.75,91.12 53.21,93.66 53.21,117.79 | 53.21,117.79 E31.14 | 53.21,117.79 47.18,117.79 E31.11
N$5  (via drill 0.51)
  Top 0.305: v60.2,88.9 60.2,88.58 61.79,88.58 E1.91 | v58.29,90.81 56.07,93.03 56.07,119.06 E31.15
  Bottom 0.305: v60.2,88.9 v58.29,90.81 | E31.12 48.77,119.38 49.72,120.33 54.16,120.33 55.12,119.38 E31.15
N$6  (via drill 0.51)
  Top 0.305: v60.2,90.17 60.2,89.85 61.79,89.85 E1.89
  Bottom 0.305: v60.2,90.17 58.61,91.76 55.75,91.76 54.16,93.34 54.16,118.43 56.71,118.43 57.66,119.38 | 57.66,119.38 56.07,120.97 47.18,120.97 47.18,118.75 47.5,118.43 49.09,118.43 50.04,119.38 E31.13 | 57.66,119.38 E31.16
N$7
  Top 0.305: E1.85 61.79,92.39 60.2,92.39 60.2,129.22 59.56,129.86 53.21,129.86 E31.3
N$8  (via drill 0.51)
  Top 0.305: v60.2,91.44 60.2,91.76 61.79,91.76 E1.86 | v58.29,92.71 56.71,94.3 56.71,125.41 55.75,126.36 E31.2
  Bottom 0.305: v60.2,91.44 58.93,92.71 v58.29,92.71
N$9  (via drill 0.51)
  Top 0.305: v60.52,85.09 60.52,86.68 61.79,86.68 E1.94
  Bottom 0.305: v60.52,85.09 57.66,85.09 44.64,98.11 44.64,126.05 56.71,126.05 57.66,127 E31.1
N$13
  Top 0.305: PAD10.1 E13.1
N$14
  Top 0.305: PAD11.1 E13.2
N$15
  Top 0.305: PAD12.1 E13.3
N$16
  Top 0.305: PAD13.1 E13.4
N$17
  Top 0.305: PAD14.1 E13.5
N$18
  Top 0.305: PAD15.1 E13.6
N$19
  Top 0.305: PAD16.1 E13.7
N$20
  Top 0.305: PAD17.1 E13.8
N$23
  Top 0.305: E13.16 PAD20.1
N$24
  Top 0.305: E13.15 PAD21.1
N$25
  Top 0.305: E13.14 PAD22.1
N$26
  Top 0.305: E13.13 PAD23.1
N$27
  Top 0.305: E13.12 PAD24.1
N$28
  Top 0.305: E13.11 PAD25.1
N$29
  Top 0.305: E13.10 PAD26.1
N$30
  Top 0.305: E13.9 PAD27.1
PARITY  (via drill 0.51)
  Top 0.305: v79.56,99.38 78.3,98.11 78.3,97.79 E1.58 | v181.8,89.85 257.37,14.29 U$2.AB1
  Bottom 0.305: v79.56,99.38 89.09,89.85 v181.8,89.85
RX_12_BIT\
  Top 0.305: 34.16,160.97 60.83,134.3 60.83,93.66 61.79,93.66 E1.83 | 34.16,160.97 R7.1 | 34.16,160.97 34.16,160.66 33.53,160.02 R16.2 DRIVE.FF
RX_DATA\
  Top 0.305: 34.16,166.05 61.79,138.43 61.79,95.25 E1.81 | 34.16,166.05 R8.1 | 34.16,166.05 34.16,165.74 33.53,165.1 R17.2 DRIVE.BB
RX_DONE\  (via drill 0.51)
  Top 0.305: v64.64,140.02 64.64,97.79 E1.79 | R4.1 34.16,172.09 32.89,170.81 R13.2 DRIVE.X
  Bottom 0.305: v64.64,140.02 34.48,170.18 R13.2
RX_ERROR\
  Top 0.305: E1.72 69.41,97.79 69.41,156.84 38.29,187.96 R5.1 34.16,187.32 32.89,186.06 R14.2 DRIVE.J
RX_INIT\
  Top 0.305: E1.74 68.14,96.2 68.14,95.89 67.82,95.57 62.42,95.57 62.42,152.72 34.8,180.34 R9.1
  Bottom 0.305: R9.1 DRIVE.N
RX_OUT\  (via drill 0.51)
  Top 0.305: v36.07,146.05 36.07,110.49 59.56,87 59.56,83.5 61.79,83.5 E1.99 | R3.1 34.16,151.76 32.89,150.5 R12.2 DRIVE.RR
  Bottom 0.305: v36.07,146.05 32.89,149.22 R12.2
RX_RUN\
  Top 0.305: E1.70 70.68,97.79 70.68,156.21 34.48,192.41 34.48,192.72 R6.1 34.16,192.41 32.89,191.13 R15.2 DRIVE.D
RX_SHIFT\
  Top 0.305: E1.96 63.05,85.41 63.69,85.41 64.01,85.72 65.28,85.72 65.28,83.82 63.69,82.23 58.93,82.23 58.93,87 35.11,110.81 35.11,153.35 33.53,154.94 R10.2 | R2.1 34.16,156.84 32.89,155.57 R10.2 | R10.2 DRIVE.LL
RX_TR_REQ\
  Top 0.305: 32.89,177.8 32.89,181.29 39.24,181.29 65.91,154.62 65.91,97.79 E1.77 | 32.89,177.8 R11.2 DRIVE.T | 32.89,177.8 R1.1
SKIP\
  Top 0.305: E1.11 70.68,80.01 70.68,26.35 82.74,14.29 U$2.CS1
TCK
  Top 0.305: E1.64 74.48,97.79 74.48,100.33 87.19,113.03 95.12,113.03 95.12,108.27 94.17,107.31 SV1.3
TDI  (via drill 0.51)
  Top 0.305: v67.5,79.06 67.5,80.01 E1.6 | v87.5,78.74 91.95,83.19 91.95,109.54 93.54,111.12 SV1.1
  Bottom 0.305: v67.5,79.06 87.19,79.06 v87.5,78.74
TDO  (via drill 0.51)
  Top 0.305: v68.45,99.38 67.5,98.42 67.5,97.79 E1.75
  Bottom 0.305: v68.45,99.38 77.98,108.9 93.22,108.9 SV1.2
TMS  (via drill 0.51)
  Top 0.305: v74.48,82.55 74.48,81.6 E1.17 | v92.9,83.82 93.54,84.45 93.54,103.5 SV1.4
  Bottom 0.305: v74.48,82.55 75.76,83.82 v92.9,83.82
TP3  (via drill 0.51)
  Top 0.305: v77.03,44.45 77.03,80.01 E1.21
  Bottom 0.305: v77.03,44.45 106.55,14.92 107.51,14.92 108.14,14.29 U$2.CH2
TP4  (via drill 0.51)
  Top 0.305: v104.01,15.24 75.76,43.5 75.76,80.01 E1.19
  Bottom 0.305: v104.01,15.24 104.97,14.29 U$2.CJ2
TR_SKIP\  (via drill 0.51)
  Top 0.305: v77.34,92.71 77.03,93.03 77.03,96.2 E1.60 | v57.97,86.04 55.43,83.5 55.43,14.29 U$2.DB1
  Bottom 0.305: v77.34,92.71 70.68,86.04 v57.97,86.04
VCC  (via drill 0.51)
  Top 0.305: 65.28,87.31 66.55,87.31 66.55,83.5 | 65.28,87.31 63.69,87.31 | 63.69,87.31 63.05,87.31 E1.93 | 66.55,83.5 66.55,81.6 E1.5 | 63.69,87.31 63.69,89.22 63.05,89.22 E1.90 | 66.55,83.5 75.12,83.5 76.39,82.23 76.39,81.6 E1.20 | 65.28,93.03 63.05,93.03 E1.84 | 65.28,87.31 65.28,93.03 | E1.36 85.28,86.04 v87.19,86.04 87.5,86.04 87.5,88.27 86.55,89.22 85.28,89.22 E1.41 | C2.1 71.95,100.01 71.95,97.79 E1.68 71.95,96.2 71.95,93.03 65.28,93.03 | E1.53 81.79,97.79 81.79,100.33 C1.1
  Bottom 0.305: U$2.CA2 127.19,14.29 112.59,28.89 112.59,34.29 C43.+ | v190.69,15.24 190.69,14.29 U$2.BA2 | U$2.AA2 260.54,14.29 249.75,25.08 249.75,34.29 C45.+

### Text on the board
Bottom: RX8-E Omnibus Interface M8357 | VRS
tPlace: RX8-E Omnibus Interface M8357 | VRS